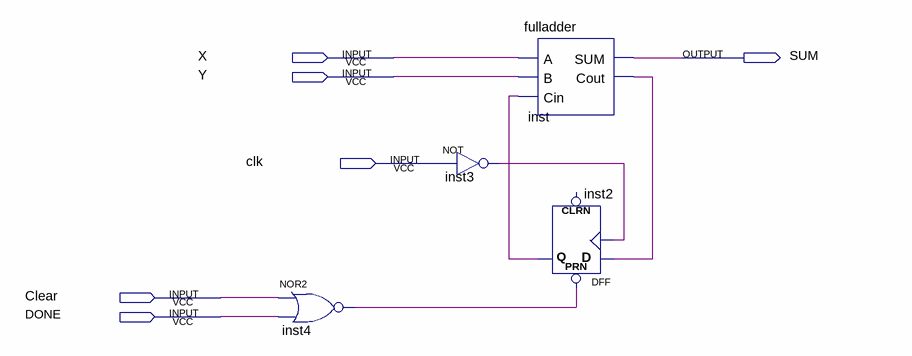
[diagram p0: schematic sheet]
// Quartus schematic serial adder.bdf as structural Verilog: 4 symbols, 6 pins
module \serial_adder  (
  input  X,
  input  Y,
  input  clk,
  input  Clear,
  input  DONE,
  output SUM
);

  wire inst2_q, inst3_out, inst4_out, inst_cout;

  nor inst4 (inst4_out, Clear, DONE);
  not inst3 (inst3_out, clk);
  fulladder inst (.A(X), .B(Y), .Cin(inst2_q), .SUM(SUM), .Cout(inst_cout));
  DFF inst2 (.CLK(inst3_out), .D(inst_cout), .PRN(inst4_out), .Q(inst2_q));  // open: CLRN
endmodule
